# EasyEDA schematic SCH_fateh_pre-charge_circuit0_draft1.json
TITLE: pre-charge_circuit0; REV: 1.2; Date: 2022-05-05; Sheet: 1/1; Drawn By: HKSF; Company: fateh
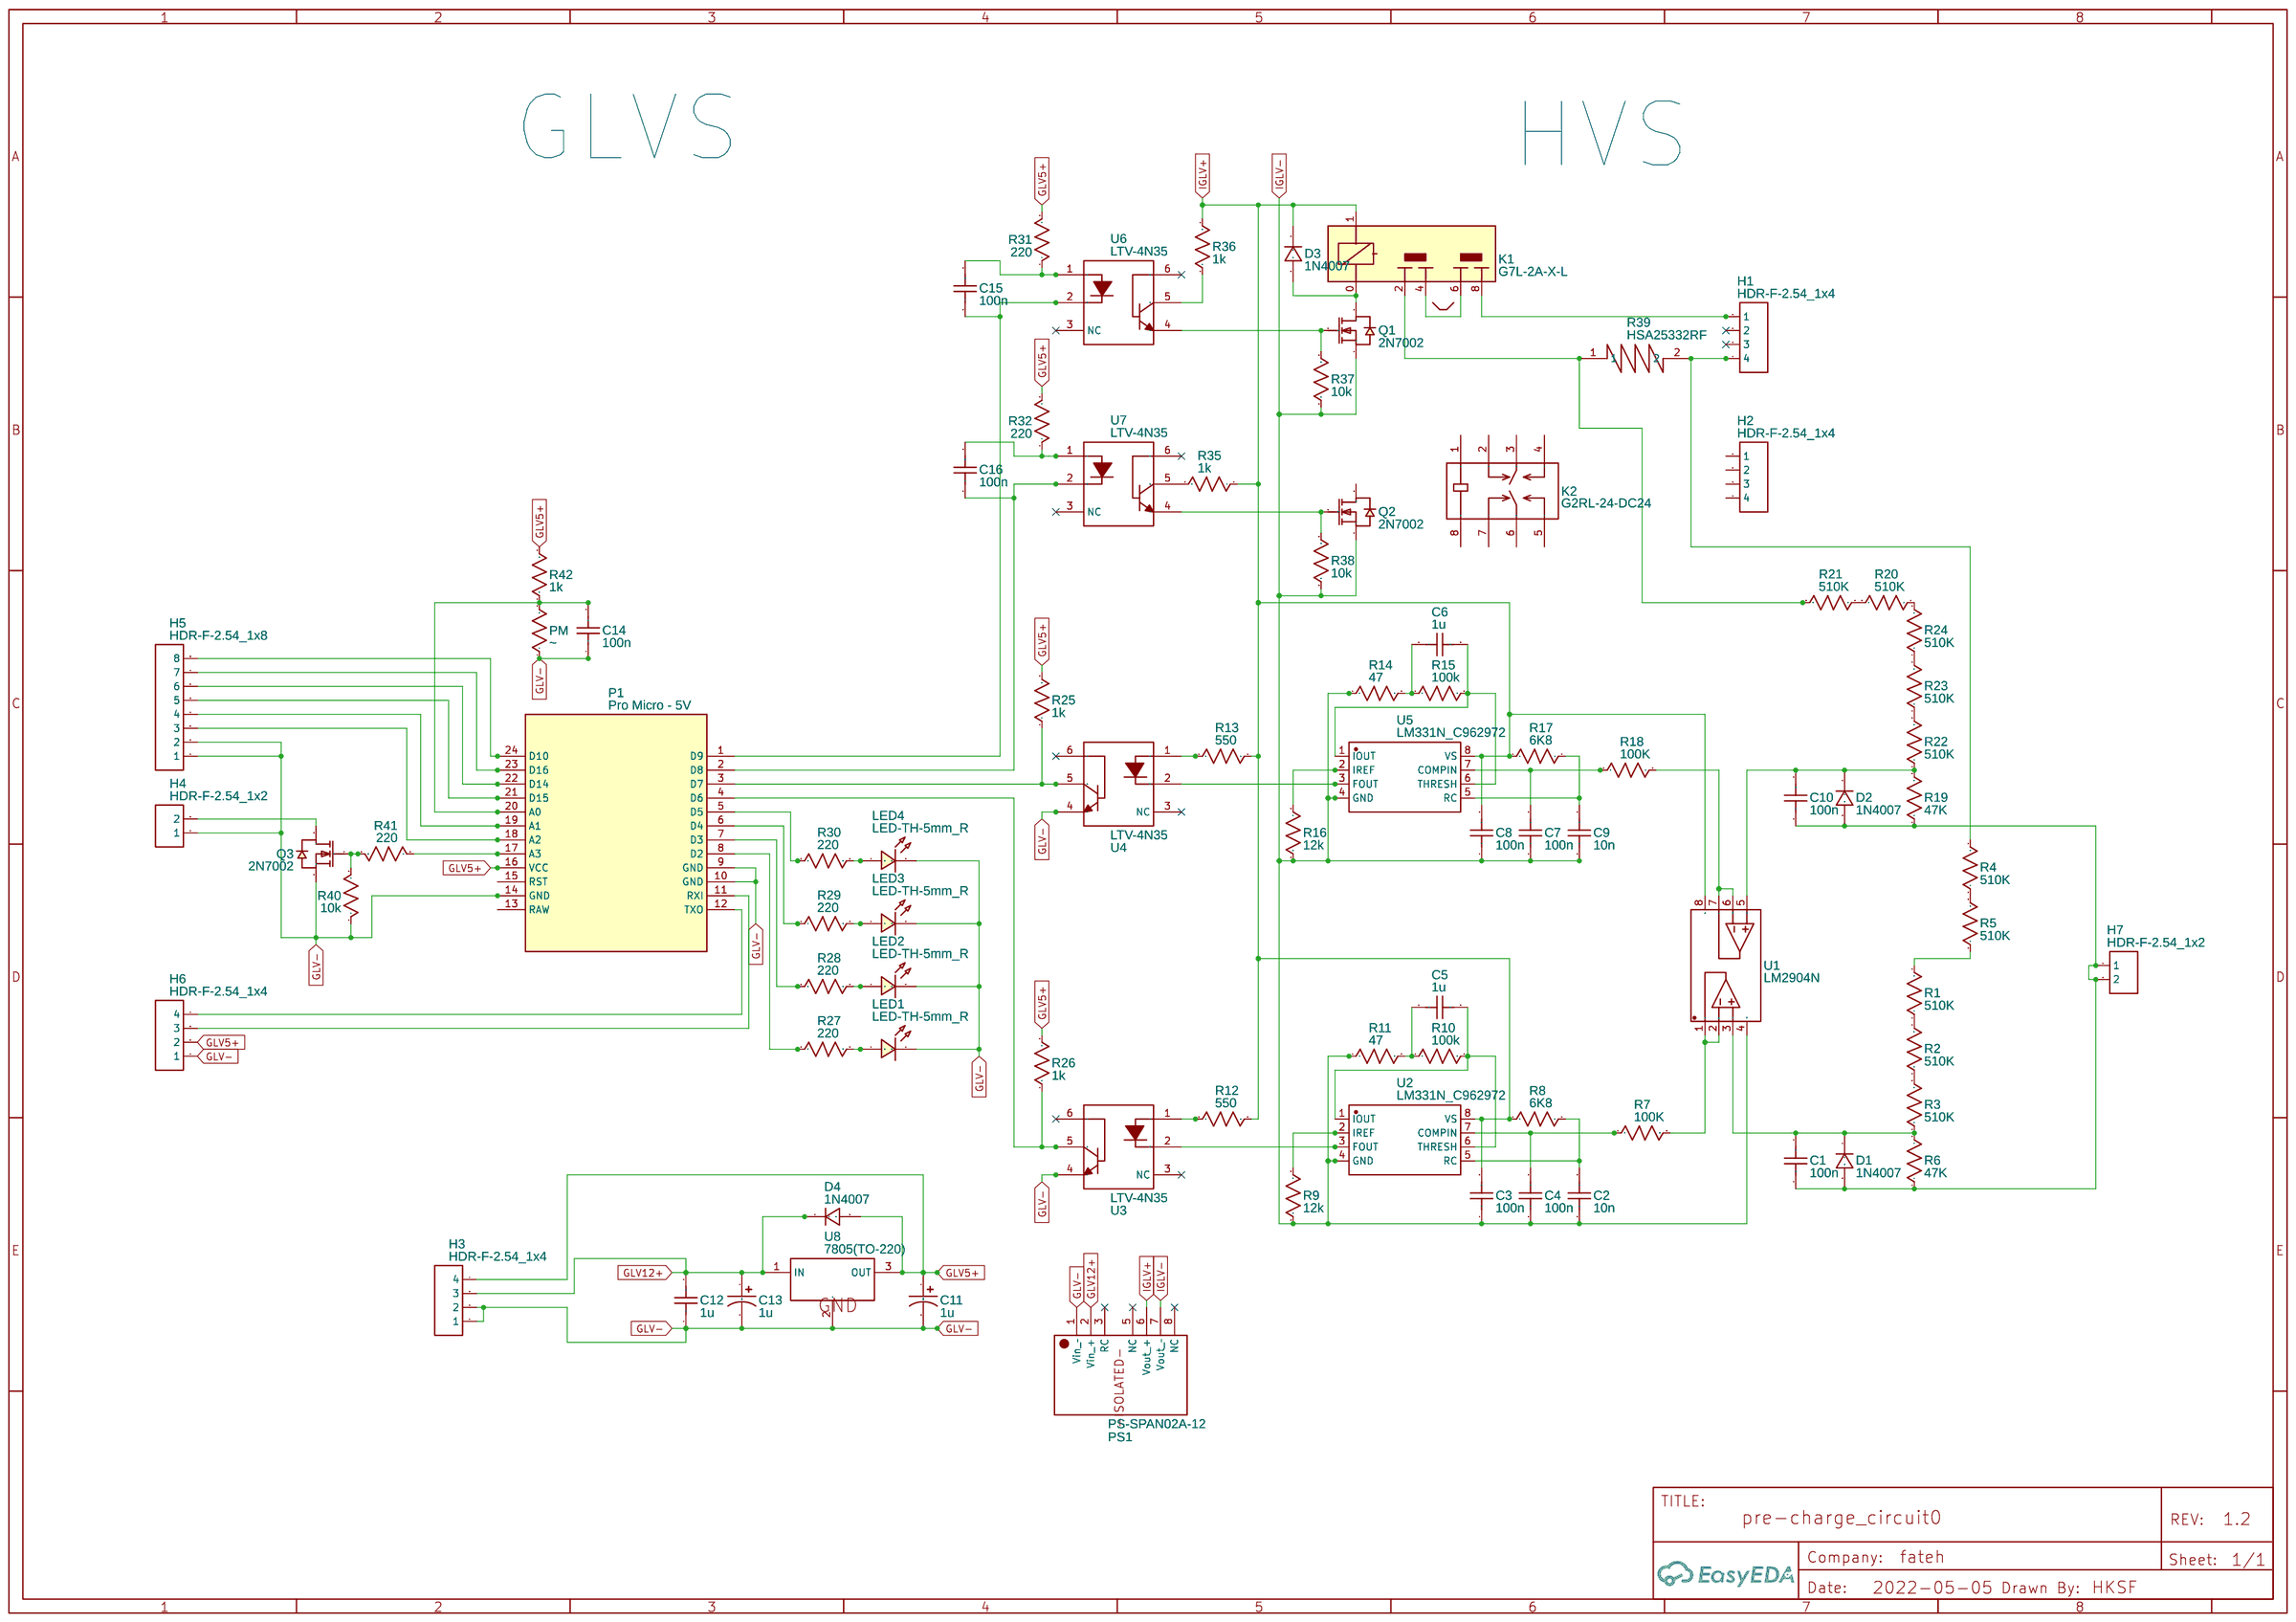
[diagram p0: schematic sheet]

## Parts
C1  100n  [RAD-0.1]
C2  10n  [RAD-0.1]
C3  100n  [RAD-0.1]
C4  100n  [RAD-0.1]
C5  1u  [RAD-0.1]
C6  1u  [RAD-0.1]
C7  100n  [RAD-0.1]
C8  100n  [RAD-0.1]
C9  10n  [RAD-0.1]
C10  100n  [RAD-0.1]
C11  1u  [CAP-D12.5×F5.0]
C12  1u  [RAD-0.1]
C13  1u  [CAP-D12.5×F5.0]
C14  100n  [RAD-0.1]
C15  100n  [RAD-0.1]
C16  100n  [RAD-0.1]
D1  1N4007  [DO-41_BD2.4-L4.7-P8.70-D0.9-RD]
D2  1N4007  [DO-41_BD2.4-L4.7-P8.70-D0.9-RD]
D3  1N4007  [DO-41_BD2.4-L4.7-P8.70-D0.9-RD]
D4  1N4007  [DO-41_BD2.4-L4.7-P8.70-D0.9-RD]
H1  HDR-F-2.54_1x4  [HDR-F-2.54_1X4]
H2  HDR-F-2.54_1x4  [HDR-F-2.54_1X4]
H3  HDR-F-2.54_1x4  [HDR-F-2.54_1X4]
H4  HDR-F-2.54_1x2  [HDR-F-2.54_1X2]
H5  HDR-F-2.54_1x8  [HDR-F-2.54_1X8]
H6  HDR-F-2.54_1x4  [HDR-F-2.54_1X4]
H7  HDR-F-2.54_1x2  [HDR-F-2.54_1X2]
K1  G7L-2A-X-L  [G7L-2A-X-L]
K2  G2RL-24-DC24  [RELAY-TH_G2RL-2]
LED1  LED-TH-5mm_R  [LED-TH_BD5.0_RED]
LED2  LED-TH-5mm_R  [LED-TH_BD5.0_RED]
LED3  LED-TH-5mm_R  [LED-TH_BD5.0_RED]
LED4  LED-TH-5mm_R  [LED-TH_BD5.0_RED]
P1  Pro Micro - 5V  [PRO MICRO - 5V]
PM  -  [R_AXIAL-0.3]
PS1  PS-SPAN02A-12  [PS-SPAN02A]
Q1  2N7002  [SOT-23_L2.9-W1.3-P0.95-LS2.4-BR]
Q2  2N7002  [SOT-23_L2.9-W1.3-P0.95-LS2.4-BR]
Q3  2N7002  [SOT-23_L2.9-W1.3-P0.95-LS2.4-BR]
R1  510K  [R_AXIAL-0.3]
R2  510K  [R_AXIAL-0.3]
R3  510K  [R_AXIAL-0.3]
R4  510K  [R_AXIAL-0.3]
R5  510K  [R_AXIAL-0.3]
R6  47K  [R_AXIAL-0.3]
R7  100K  [R_AXIAL-0.3]
R8  6K8  [R_AXIAL-0.3]
R9  12k  [R_AXIAL-0.3]
R10  100k  [R_AXIAL-0.3]
R11  47  [R_AXIAL-0.3]
R12  550  [R_AXIAL-0.3]
R13  550  [R_AXIAL-0.3]
R14  47  [R_AXIAL-0.3]
R15  100k  [R_AXIAL-0.3]
R16  12k  [R_AXIAL-0.3]
R17  6K8  [R_AXIAL-0.3]
R18  100K  [R_AXIAL-0.3]
R19  47K  [R_AXIAL-0.3]
R20  510K  [R_AXIAL-0.3]
R21  510K  [R_AXIAL-0.3]
R22  510K  [R_AXIAL-0.3]
R23  510K  [R_AXIAL-0.3]
R24  510K  [R_AXIAL-0.3]
R25  1k  [R_AXIAL-0.3]
R26  1k  [R_AXIAL-0.3]
R27  220  [R_AXIAL-0.3]
R28  220  [R_AXIAL-0.3]
R29  220  [R_AXIAL-0.3]
R30  220  [R_AXIAL-0.3]
R31  220  [R_AXIAL-0.3]
R32  220  [R_AXIAL-0.3]
R35  1k  [R_AXIAL-0.3]
R36  1k  [R_AXIAL-0.3]
R37  10k  [R_AXIAL-0.3]
R38  10k  [R_AXIAL-0.3]
R39  HSA25332RF  [HSA25332RF]
R40  10k  [R_AXIAL-0.3]
R41  220  [R_AXIAL-0.3]
R42  1k  [R_AXIAL-0.3]
U1  LM2904N  [DIP-8_L9.8-W6.6-P2.54-LS7.6-BL]
U2  LM331N_C962972  [DIP-8_L9.6-W6.4-P2.54-LS7.9-BL]
U3  LTV-4N35  [DIP-6_L7.3-W6.5-P2.54-LS7.6-BL]
U4  LTV-4N35  [DIP-6_L7.3-W6.5-P2.54-LS7.6-BL]
U5  LM331N_C962972  [DIP-8_L9.6-W6.4-P2.54-LS7.9-BL]
U6  LTV-4N35  [DIP-6_L7.3-W6.5-P2.54-LS7.6-BL]
U7  LTV-4N35  [DIP-6_L7.3-W6.5-P2.54-LS7.6-BL]
U8  7805(TO-220)  [TO-220-3_L10.0-W4.5-P2.54-L]

## Library data of the parts
C1-C10 C12 C14-C16 = C_RAD-0.1_US: Contributor: LCEDA_Lib
C11 C13 = CE_TH_D12.5×F5.0_US: Contributor: LCEDA_Lib
D1-D4 = 1N4007: Supplier: LCSC; Manufacturer: SEMTECH; Supplier Part: C106903; Contributor: LCEDA_Lib
H1-H3 H6 = HDR-F-2.54_1x4: Supplier Part: C225501; Supplier: LCSC; Contributor: LCEDA_Lib
H4 H7 = HDR-F-2.54_1x2: Supplier Part: C49661; Supplier: LCSC; Contributor: LCEDA_Lib
H5 = HDR-F-2.54_1x8: Supplier Part: C225505; Supplier: LCSC; Contributor: LCEDA_Lib
K1 = G7L-2A-X-L: Contributor: anderslundblad
K2 = G2RL-24-DC24: Supplier: LCSC; Supplier Part: C397256; Manufacturer: Omron Electronics; Contributor: LCSC; JLCPCB Part Class: Extended Part
LED1-LED4 = LED-TH-5mm_R: Manufacturer: EVERLIGHT(台湾亿光); Manufacturer Part: 333-2SURD/S530-A3; Supplier Part: C87271; Supplier: LCSC; Contributor: LCEDA_Lib
P1 = Pro Micro - 5V: sourceId: 1T5FDZYC8
PM R1-R32 R35-R38 R40-R42 = R_AXIAL-0.3_US: Contributor: LCEDA_Lib
PS1 = PS-SPAN02A-12: Manufacturer: MEAN WELL; Manufacturer Part: SPAN02A-12; Supplier: Mouser; Supplier Part: 709-SPAN02A-12; link: https://www.mouser.com/ProductDetail/MEAN-WELL/SPAN02A-12; Contributor: algray
Q1-Q3 = 2N7002: Supplier: LCSC; Manufacturer: Nexperia; Manufacturer Part: 2N7002,215; image: //image.lceda.cn/szlcsc/C65189.jpg; Supplier Part: C65189; Paste Type: expand; Contributor: LCEDA_Lib
R39 = HSA25332RF: Contributor: Tomasejackson
U1 = LM2904N: Supplier: LCSC; Supplier Part: C232852; Manufacturer: ON Semicon; Contributor: LCSC
U2 U5 = LM331N_C962972: Supplier: LCSC; Supplier Part: C962972; Manufacturer: TI(德州仪器); Manufacturer Part: LM331N; link: https://atta.szlcsc.comnull; Contributor: LCSC
U3 U4 U6 U7 = LTV-4N35: Supplier: LCSC; Supplier Part: C343878; Manufacturer: Lite-On; Contributor: LCSC; JLCPCB Part Class: Extended Part
U8 = 7805(TO-220): Supplier: LCSC; Manufacturer: STMicroelectronics; Manufacturer Part: L7805CV-DG; Supplier Part: C3795; Contributor: LCEDA_Lib

## Nets
GLV5+: C11.1 D4.2 H3.4 H6.2 P1.16(VCC) R25.2 R26.2 R31.2 R32.2 R42.2 U8.3(OUT)
GLV12+: C12.2 C13.1 D4.1 H3.3 PS1.2(Vin +) U8.1(IN)
GLV-: C11.2 C12.1 C13.2 C14.1 H3.1 H3.2 H4.1 H5.1 H5.2 H6.1 LED1.2 LED2.2 LED3.2 LED4.2 P1.9(GND) P1.10(GND) P1.14(GND) PM.1 PS1.1(Vin –) Q3.2(S) R40.1 U3.4 U4.4 U8.2(GND)
IGLV+: C3.2 C8.2 D3.1 K1.1 PS1.6(Vout +) R8.1 R12.2 R13.2 R17.1 R35.1 R36.2 U1.8(+VS) U2.8(VS) U5.8(VS)
IGLV-: C2.1 C3.1 C4.1 C7.1 C8.1 C9.1 PS1.7(Vout –) Q1.2(S) Q2.2(S) R9.1 R11.1 R14.1 R16.1 R37.1 R38.1 U1.4(-VS) U2.4(GND) U5.4(GND)
Net-(C1-1): C1.1 C10.1 D1.2 D2.2 H7.1 H7.2 R6.1 R19.1
Net-(C1-2): C1.2 D1.1 R3.1 R6.2 U1.3(VDD)
Net-(C2-2): C2.2 R8.2 U2.5(RC)
Net-(C4-2): C4.2 R7.1 U2.7(COMPIN)
Net-(C5-1): C5.1 R10.1 R11.2
Net-(C5-2): C5.2 R10.2 U2.1(IOUT) U2.6(THRESH)
Net-(C6-1): C6.1 R14.2 R15.1
Net-(C6-2): C6.2 R15.2 U5.1(IOUT) U5.6(THRESH)
Net-(C7-2): C7.2 R18.1 U5.7(COMPIN)
Net-(C9-2): C9.2 R17.2 U5.5(RC)
Net-(C10-2): C10.2 D2.1 R19.2 R22.1 U1.5
Net-(C14-2): C14.2 P1.20(A0) PM.2 R42.1
Net-(C15-1): C15.1 P1.1(D9) U6.2
Net-(C15-2): C15.2 R31.1 U6.1
Net-(C16-1): C16.1 P1.2(D8) U7.2
Net-(C16-2): C16.2 R32.1 U7.1
Net-(D3-2): D3.2 K1.0 Q1.3(D)
Net-(H1-1): H1.1 K1.8
Net-(H1-4): H1.4 R4.2 R39.2
Net-(H4-2): H4.2 Q3.3(D)
Net-(H5-3): H5.3 P1.18(A2)
Net-(H5-4): H5.4 P1.19(A1)
Net-(H5-5): H5.5 P1.21(D15)
Net-(H5-6): H5.6 P1.22(D14)
Net-(H5-7): H5.7 P1.23(D16)
Net-(H5-8): H5.8 P1.24(D10)
Net-(H6-3): H6.3 P1.11(RXI)
Net-(H6-4): H6.4 P1.12(TXO)
Net-(K1-2): K1.2 R21.2 R39.1
Net-(K1-4): K1.4 K1.6
Net-(LED1-1): LED1.1 R27.2
Net-(LED2-1): LED2.1 R28.2
Net-(LED3-1): LED3.1 R29.2
Net-(LED4-1): LED4.1 R30.2
Net-(P1-3): P1.3(D7) R25.1 U4.5
Net-(P1-4): P1.4(D6) R26.1 U3.5
Net-(P1-5): P1.5(D5) R30.1
Net-(P1-6): P1.6(D4) R29.1
Net-(P1-7): P1.7(D3) R28.1
Net-(P1-8): P1.8(D2) R27.1
Net-(P1-17): P1.17(A3) R41.1
Net-(Q1-1): Q1.1(G) R37.2 U6.4
Net-(Q2-1): Q2.1(G) R38.2 U7.4
Net-(Q3-1): Q3.1(G) R40.2 R41.2
Net-(R1-1): R1.1 R2.2
Net-(R1-2): R1.2 R5.1
Net-(R2-1): R2.1 R3.2
Net-(R4-1): R4.1 R5.2
Net-(R7-2): R7.2 U1.1 U1.2
Net-(R9-2): R9.2 U2.2(IREF)
Net-(R12-1): R12.1 U3.1
Net-(R13-1): R13.1 U4.1
Net-(R16-2): R16.2 U5.2(IREF)
Net-(R18-2): R18.2 U1.6 U1.7
Net-(R20-1): R20.1 R24.2
Net-(R20-2): R20.2 R21.1
Net-(R22-2): R22.2 R23.1
Net-(R23-2): R23.2 R24.1
Net-(R35-2): R35.2 U7.5
Net-(R36-1): R36.1 U6.5
Net-(U2-3): U2.3(FOUT) U3.2
Net-(U4-2): U4.2 U5.3(FOUT)

Not connected (* = marked no-connect by the designer): H1 2* 3*; H2 1 2 3 4; K2 1 2 3 4 5 6 7 8; P1 13(RAW) 15(RST); PS1 3(RC)* 5(NC)* 8(NC)*; Q2 3(D); U3 3(NC)* 6(B)*; U4 3(NC)* 6(B)*; U6 3(NC)* 6(B)*; U7 3(NC)* 6(B)*

## Notes on the sheet
- GLVS
- HVS
